# EAGLE schematic telemetry-r2 (EAGLE 7.7.0)
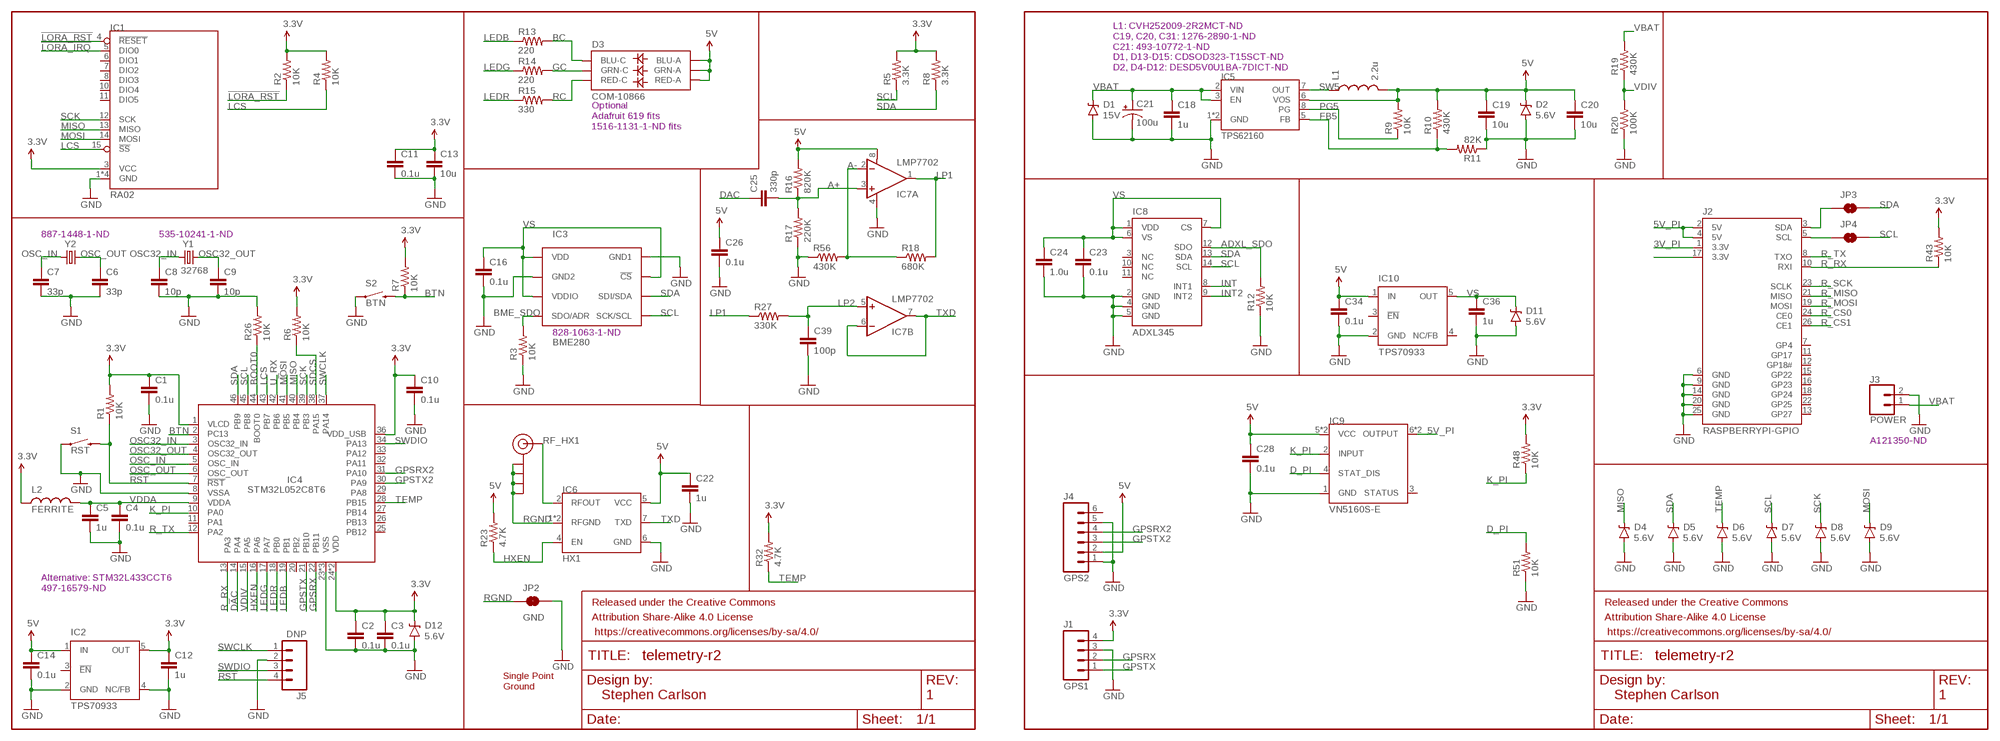
[diagram p0: schematic, sheet 1]

## Parts
C1  0.1u  CAP0805  [0805]
C2  0.1u  CAP0805  [0805]
C3  0.1u  CAP0805  [0805]
C4  0.1u  CAP0805  [0805]
C5  1u  CAP0805  [0805]
C6  33p  CAP0805  [0805]
C7  33p  CAP0805  [0805]
C8  10p  CAP0805  [0805]
C9  10p  CAP0805  [0805]
C10  0.1u  CAP0805  [0805]
C11  0.1u  CAP0805  [0805]
C12  1u  CAP0805  [0805]
C13  10u  CAP0805  [0805]
C14  0.1u  CAP0805  [0805]
C16  0.1u  CAP0805  [0805]
C18  1u  CAP0805  [0805]
C19  10u  CAP0805  [0805]
C20  10u  CAP0805  [0805]
C21  100u  CAP_POLE  [PANASONIC_E]
C22  1u  CAP0805  [0805]
C23  0.1u  CAP0805  [0805]
C24  1.0u  CAP0805  [0805]
C25  330p  CAP0805  [0805]
C26  0.1u  CAP0805  [0805]
C28  0.1u  CAP0805  [0805]
C34  0.1u  CAP0805  [0805]
C36  1u  CAP0805  [0805]
C39  100p  CAP0805  [0805]
D1  15V  DIODE-ZENER5.6V  [SOD-323]
D2  5.6V  DIODE-ZENER5.6V  [SOD-323]
D3  COM-10866  LED-TRICOLOR-5050NO_IC  [LED-TRICOLOR-5050]
D4  5.6V  DIODE-ZENER5.6V  [SOD-323]
D5  5.6V  DIODE-ZENER5.6V  [SOD-323]
D6  5.6V  DIODE-ZENER5.6V  [SOD-323]
D7  5.6V  DIODE-ZENER5.6V  [SOD-323]
D8  5.6V  DIODE-ZENER5.6V  [SOD-323]
D9  5.6V  DIODE-ZENER5.6V  [SOD-323]
D11  5.6V  DIODE-ZENER5.6V  [SOD-323]
D12  5.6V  DIODE-ZENER5.6V  [SOD-323]
FRAME1  FRAME-LETTERNO_PACKAGE  [DUMMY]
FRAME2  FRAME-LETTERNO_PACKAGE  [DUMMY]
IC1  RA02  [RA02]
IC2  TPS70933  TPS77033  [SOT23-DBV]
IC3  BME280  [BME280_LGA]
IC4  STM32L052C8T6  STM32L07C  [TQFP48]
IC5  TPS62160  [MSOP8]
IC6  HX1  [HX1]
IC7  LMP7702  OPAMP-DUALU  [SO08]
IC8  ADXL345  [LGA14]
IC9  VN5160S-E  [SO8]
IC10  TPS70933  TPS77033  [SOT23-DBV]
J1  GPS1  M04PTH  [1X04]
J2  RASPBERRYPI-GPIO  [2X13-PI]
J3  POWER  1X02  [1X02_SCREW]
J4  GPS2  M06SMD-1MM  [1X06-1MM]
J5  DNP  M04LOCK  [1X04_LOCK]
J6  SMA_EDGE  [SMA-EDGE]
JP2  GND  JUMPER-PAD-2-NC_BY_TRACE  [PAD-JUMPER-2-NC_BY_TRACE_YES_SILK]
JP3  SDA  JUMPER-SMT_2_NO_SILK  [SMT-JUMPER_2_NO_SILK]
JP4  SCL  JUMPER-SMT_2_NO_SILK  [SMT-JUMPER_2_NO_SILK]
L1  2.2u  INDUCTOR1008  [1008]
L2  FERRITE  INDUCTOR1206  [1206]
R1  10K  RESISTOR0805-RES  [0805]
R2  10K  RESISTOR0805-RES  [0805]
R3  10K  RESISTOR0805-RES  [0805]
R4  10K  RESISTOR0805-RES  [0805]
R5  3.3K  RESISTOR0805-RES  [0805]
R6  10K  RESISTOR0805-RES  [0805]
R7  10K  RESISTOR0805-RES  [0805]
R8  3.3K  RESISTOR0805-RES  [0805]
R9  10K  RESISTOR0805-RES  [0805]
R10  430K  RESISTOR0805-RES  [0805]
R11  82K  RESISTOR0805-RES  [0805]
R12  10K  RESISTOR0805-RES  [0805]
R13  220  RESISTOR0805-RES  [0805]
R14  220  RESISTOR0805-RES  [0805]
R15  330  RESISTOR0805-RES  [0805]
R16  820K  RESISTOR0805-RES  [0805]
R17  220K  RESISTOR0805-RES  [0805]
R18  680K  RESISTOR0805-RES  [0805]
R19  430K  RESISTOR0805-RES  [0805]
R20  100K  RESISTOR0805-RES  [0805]
R23  4.7K  RESISTOR0805-RES  [0805]
R26  10K  RESISTOR0805-RES  [0805]
R27  330K  RESISTOR0805-RES  [0805]
R32  4.7K  RESISTOR0805-RES  [0805]
R43  10K  RESISTOR0805-RES  [0805]
R48  10K  RESISTOR0805-RES  [0805]
R51  10K  RESISTOR0805-RES  [0805]
R56  430K  RESISTOR0805-RES  [0805]
S1  RST  SWITCH  [TACTILE-PTH-THIN]
S2  BTN  SWITCH  [TACTILE-PTH-THIN]
Y1  32768  CRYSTAL  [ABS25]
Y2  8M  CRYSTALTXC-7A  [CRYSTAL-TXC-7A]

## Nets
3.3V: C1.1 C2.1 C3.1 C10.1 C11.1 C12.1 C13.1 D12.C IC1.3(VCC) IC2.5(OUT) IC4.1(VLCD) IC4.24(VDD) IC4.36(VDD_USB) IC4.48(VDD) J1.4 L2.1 R1.2 R2.2 R4.2 R5.2 R6.2 R7.2 R8.2 R32.2 R43.2 R48.2
3V_PI: J2.1(3.3V)
3V_PI2: J2.17(3.3V)
5V: C14.1 C19.1 C20.1 C22.1 C26.1 C28.1 C34.1 D2.C D3.1(GRN-A) D3.2(RED-A) D3.3(BLU-A) IC2.1(IN) IC5.6(VOS) IC6.5(VCC) IC7.8(A:V+) IC9.5(VCC) IC9.8(VCC) IC10.1(IN) J4.2 L1.2 R9.2 R10.2 R16.2 R23.2
5V_PI: IC9.6(OUTPUT) IC9.7(OUTPUT) J2.2(5V) J2.4(5V)
!LORA_IRQ!: IC1.5(DIO0)
!LORA_RST!: IC1.4(!RESET!) R2.1
!RST!: IC4.7(!RST!) J5.4 R1.1 S1.2
A+: C25.2 IC7.3(A:+IN) R16.1 R17.2
A-: IC7.2(A:-IN) R18.1 R56.2
ADXL_SDO: IC8.12(SDO) R12.2
BC: D3.4(BLU-C) R13.2
BME_SDO: IC3.P$5(SDO/ADR) R3.2
BOOT0: IC4.44(BOOT0) R26.1
BTN: IC4.2(PC13) R7.1 S2.2
D_PI: IC9.4(STAT_DIS) R51.2
DAC: C25.1 IC4.14(PA4)
FB5: IC5.5(FB) R10.1 R11.2
GC: D3.6(GRN-C) R14.2
GND: C1.2 C2.2 C3.2 C4.2 C5.2 C6.2 C7.2 C8.2 C9.2 C10.2 C11.2 C12.2 C13.2 C14.2 C16.2 C18.2 C19.2 C20.2 C21.- C22.2 C23.2 C24.2 C26.2 C28.2 C34.2 C36.2 C39.2 D1.A D2.A D4.A D5.A D6.A D7.A D8.A D9.A D11.A D12.A IC1.1(GND) IC1.2(GND) IC1.9(GND) IC1.16(GND) IC2.2(GND) IC2.4(NC/FB) IC3.P$1(GND1) IC3.P$7(GND2) IC4.8(VSSA) IC4.23(VSS) IC4.35(VSS) IC4.47(VSS) IC5.1(GND) IC5.4(GND) IC6.6(GND) IC7.4(A:V-) IC8.2(GND) IC8.4(GND) IC8.5(GND) IC9.1(GND) IC10.2(GND) J1.3 J2.6(GND) J2.9(GND) J2.14(GND) J2.20(GND) J2.25(GND) J3.2 J4.1 J4.5 J5.2 JP2.2 R3.1 R11.1 R12.1 R17.1 R20.1 R26.2 R51.1 R56.1 S1.1 S2.1
GPSRX: IC4.22(PB11) J1.2
GPSRX2: IC4.31(PA10) J4.4
GPSTX: IC4.21(PB10) J1.1
GPSTX2: IC4.30(PA9) J4.3
HXEN: IC4.16(PA6) IC6.4(EN) R23.1
INT: IC8.8(INT1)
INT2: IC8.9(INT2)
K_PI: IC4.10(PA0) IC9.2(INPUT) R48.1
LCS: IC1.15(!SS!) IC4.43(PB7) R4.1
LEDB: IC4.19(PB1) R13.1
LEDG: IC4.17(PA7) R14.1
LEDR: IC4.18(PB0) R15.1
LP1: IC7.1(A:OUT) R18.2 R27.1
LP2: C39.1 IC7.5(B:+IN) R27.2
MISO: D4.C IC1.13(MISO) IC4.40(PB4)
MOSI: D9.C IC1.14(MOSI) IC4.41(PB5)
OSC32_IN: C8.1 IC4.3(OSC32_IN) Y1.1
OSC32_OUT: C9.1 IC4.4(OSC32_OUT) Y1.4
OSC_IN: C7.1 IC4.5(OSC_IN) Y2.P$1
OSC_OUT: C6.1 IC4.6(OSC_OUT) Y2.P$2
PG5: IC5.8(PG) R9.1
R_CS0: J2.24(CE0)
R_CS1: J2.26(CE1)
R_MISO: J2.21(MISO)
R_MOSI: J2.19(MOSI)
R_RX: IC4.13(PA3) J2.10(RXI) R43.1
R_SCK: J2.23(SCLK)
R_SCL: J2.5(SCL) JP4.1
R_SDA: J2.3(SDA) JP3.1
R_TX: IC4.12(PA2) J2.8(TXO)
RC: D3.5(RED-C) R15.2
RF_HX1: IC6.2(RFOUT) J6.SIG(SIGNAL)
RGND: IC6.1(RFGND) IC6.3(RFGND) J6.GND@0(GND) J6.GND@1(GND) J6.GND@2(GND) J6.GND@3(GND) JP2.1
SCK: D8.C IC1.12(SCK) IC4.39(PB3)
SCL: D7.C IC3.P$4(SCK/SCL) IC4.45(PB8) IC8.14(SCL) JP4.2 R5.1
SDA: D5.C IC3.P$3(SDI/SDA) IC4.46(PB9) IC8.13(SDA) JP3.2 R8.1
SDCS: IC4.38(PA15) R6.1
SW5: IC5.7(OUT) L1.1
SWCLK: IC4.37(PA14) J5.1
SWDIO: IC4.34(PA13) J5.3
TEMP: D6.C IC4.28(PB15) R32.1
TXD: IC6.7(TXD) IC7.6(B:-IN) IC7.7(B:OUT)
U_RX: IC4.42(PB6)
VBAT: C18.1 C21.+ D1.C IC5.2(VIN) IC5.3(EN) J3.1 R19.2
VDDA: C4.1 C5.1 IC4.9(VDDA) L2.2
VDIV: IC4.15(PA5) R19.1 R20.2
VS: C16.1 C23.1 C24.1 C36.1 D11.C IC3.P$2(!CS) IC3.P$6(VDDIO) IC3.P$8(VDD) IC8.1(VDD) IC8.6(VS) IC8.7(CS) IC10.5(OUT)
Unconnected: IC1.6(DIO1) IC1.7(DIO2) IC1.8(DIO3) IC1.10(DIO4) IC1.11(DIO5) IC2.3(!EN) IC4.11(PA1) IC4.20(PB2) IC4.25(PB12) IC4.26(PB13) IC4.27(PB14) IC4.29(PA8) IC4.32(PA11) IC4.33(PA12) IC8.3(NC) IC8.10(NC) IC8.11(NC) IC9.3(STATUS) IC10.3(!EN) IC10.4(NC/FB) J2.7(GP4) J2.11(GP17) J2.12(GP18#) J2.13(GP27) J2.15(GP22) J2.16(GP23) J2.18(GP24) J2.22(GP25) J4.6

## Notes on the sheet
- L1: CVH252009-2R2MCT-ND
  C19, C20, C31: 1276-2890-1-ND
  C21: 493-10772-1-ND
  D1, D13-D15: CDSOD323-T15SCT-ND 
  D2, D4-D12: DESD5V0U1BA-7DICT-ND
- Optional
  Adafruit 619 fits
  1516-1131-1-ND fits
- 887-1448-1-ND | 535-10241-1-ND
- 828-1063-1-ND
- A121350-ND
- Alternative: STM32L433CCT6
  497-16579-ND
- Single Point
  Ground
- Stephen Carlson | 1 | Stephen Carlson | 1

## Library data of the parts
C1-C14 C16 C18-C20 C22-C26 C28 C34 C36 C39 = SparkFun-Passives:CAP: Capacitor Standard 0603 ceramic capacitor, and 0.1" leaded capacitor.
C21 = SparkFun-Passives:CAP_POL: Capacitor Polarized These are standard SMD and PTH capacitors. Normally 10uF, 47uF, and 100uF in electrolytic and tantalum varieties. Always verify the external diameter of the through hole cap, it varies with capacity, voltage, and manufacturer. The EIA devices should be standard.
D1 = SparkFun-DiscreteSemi:DIODE-ZENER: Zener Diode Production Part - 8199 3.4V Zener Voltage; PROD_ID: DIO-12442; VALUE: 5.6V
D2 D4-D9 D11 D12 = SparkFun-DiscreteSemi:DIODE-ZENER: Zener Diode Production Part - 8199 3.4V Zener Voltage; PROD_ID: DIO-12442
D3 = SparkFun-LED:LED-TRICOLOR-5050
FRAME1 FRAME2 = SparkFun-Aesthetics:FRAME-LETTER: Schematic Frame Standard 8.5x11 US Letter frame; DESIGNER: Nobody; VERSION: v01
IC1 = HAB:RA02: RA-02 LoRA RA-02 LoRA module with integrated u.FL connector
IC2 IC10 = texas:TPS770*: ULTRALOW-POWER 50-mA LOW-DROPOUT LINEAR REGULATORS 50-mA Low-Dropout Regulator Source: http://focus.ti.com/lit/ds/symlink/tps77001.pdf; MF: TEXAS INSTRUMENTS; MPN: TPS77033DBVT; OC_FARNELL: 8461570; OC_NEWARK: 77C1187
IC3 = BME280ComponentLibrary:BME280; PROD_ID: IC-13090
IC4 = stm32xx:STM32L07*C: STM32L07XC STM32L07X series in LQFP-48 package
IC5 = HAB:TPS62160: TPS62160 Adjustable switch-mode D-CAP2 regulator
IC6 = HAB:HX1: Radiometrix HX1 High-power VHF Narrow Band 300 mW Transmitter
IC7 = SparkFun-AnalogIC:OPAMP-DUAL: Generic op-amp footprint
IC8 = SparkFun-Sensors:ADXL345: 3-axis SPI/I2C 2/4/8/16g accelerometer
IC9 = HAB:VN5160S-E: VN5160S-E Single channel high side driver for automotive applications
J1 J5 = SparkFun-Connectors:M04: Header 4 Standard 4-pin 0.1" header. Use with straight break away headers (SKU : PRT-00116), right angle break away headers (PRT-00553), swiss pins (PRT-00743), machine pins (PRT-00117), and female headers (PRT-00115). Molex polarized connector foot print use with SKU : PRT-08231 with associated crimp pins and housings. 1MM SMD Version SKU: PRT-10208; PROD_ID: CONN-09696
J2 = HAB:RASPBERRYPI-GPIO: RASPBERRY PI I/O HEADER As defined for the Revision 2 Pi.
J3 = HAB:1X02: 1X02 1x2 header
J4 = SparkFun-Connectors:M06: Header 6 Standard 6-pin 0.1" header. Use with straight break away headers (SKU : PRT-00116), right angle break away headers (PRT-00553), swiss pins (PRT-00743), machine pins (PRT-00117), and female headers (PRT-00115). Molex polarized connector foot print use with SKU : PRT-08094 with associated crimp pins and housings. NOTES ON THE VARIANTS LOCK and LOCK_LONGPADS... This footprint was designed to help hold the alignment of a through-hole component (i.e. 6-pin header) while soldering it into place. You may notice that each hole has been shifted either up or down by 0.005 of an inch from it's more standard position (which is a perfectly straight line). This slight alteration caused the pins (the squares in the middle) to touch the edges of the holes. Because they are alternating, it causes a "brace" to hold the component in place. 0.005 has proven to be the perfect amount of "off-center" position when using our standard breakaway headers. Although looks a little odd when you look at the bare footprint, once you have a header in there, the alteration is very hard to notice. Also,if you push a header all the way into place, it is covered up entirely on the bottom side. This idea of altering the position of holes to aid alignment will be further integrated into the Sparkfun Library for other footprints. It can help hold any component with 3 or more connection pins.
J6 = SparkFun-Connectors:SMA_EDGE: SMA Antenna Connector End launch SMA connector. The paste layer has been removed so that the connector can be hand soldered onto the board after reflow.
JP2 = SparkFun-Passives:JUMPER-PAD-2-NC_BY_TRACE
JP3 JP4 = SparkFun-Jumpers:JUMPER-SMT_2_NO: Normally open jumper This jumper has two pads in close proximity to each other. Apply solder to close the connection. Round pads are easier to solder for beginners, but are a lot larger. SparkFun Product that uses the round pads: SparkFun EL Sequencer <https://www.sparkfun.com/products/12781>
L1 L2 = HAB:INDUCTOR: INDUCTOR Standard inductor, with some new packages Why do inductors never come in standard packages!?
R1-R20 R23 R26 R27 R32 R43 R48 R51 R56 = SparkFun-Passives:RESISTOR: Resistor Basic schematic elements and footprints for 0603, 1206, and PTH resistors.
S1 S2 = HAB:SWITCH: SWITCH Package for the MJTP1250, a thinner and lighter PTH push button switch.
Y1 = HAB:CRYSTAL: CRYSTAL Crystal oscillators in packages not in SparkFun-FreqCtl
Y2 = SparkFun-FreqCtrl:CRYSTAL: Various standard crystals. Proven footprints.